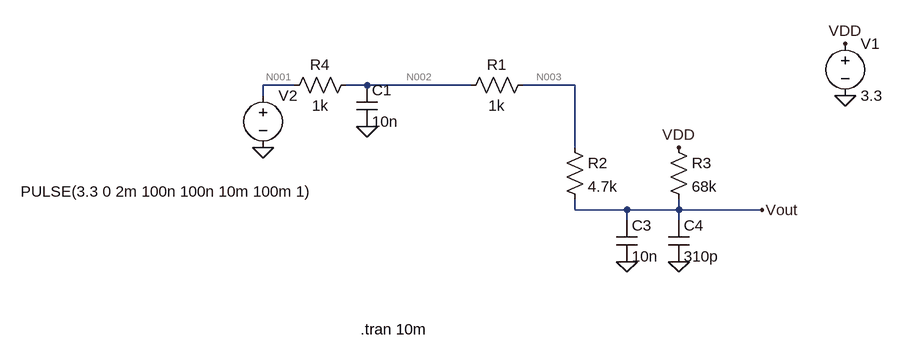
[diagram p0: schematic Press_Detection_Transient.asc]
Press_Detection_Transient.asc, the LTspice schematic file:
Version 4
SHEET 1 880 680
WIRE -192 160 -240 160
WIRE -80 160 -112 160
WIRE 80 160 -80 160
WIRE 240 160 160 160
WIRE -240 176 -240 160
WIRE 240 256 240 160
WIRE 240 352 240 336
WIRE 320 352 240 352
WIRE 400 352 400 336
WIRE 400 352 320 352
WIRE 528 352 400 352
WIRE 320 368 320 352
WIRE 400 368 400 352
FLAG 320 432 0
FLAG 400 432 0
FLAG -80 224 0
FLAG 528 352 Vout
FLAG 400 256 VDD
FLAG 656 96 VDD
FLAG 656 176 0
FLAG -240 256 0
SYMBOL res 176 144 R90
WINDOW 0 0 56 VBottom 2
WINDOW 3 32 56 VTop 2
SYMATTR InstName R1
SYMATTR Value 1k
SYMBOL cap -96 160 R0
SYMATTR InstName C1
SYMATTR Value 10n
SYMBOL res 224 240 R0
SYMATTR InstName R2
SYMATTR Value 4.7k
SYMBOL cap 304 368 R0
SYMATTR InstName C3
SYMATTR Value 10n
SYMBOL cap 384 368 R0
SYMATTR InstName C4
SYMATTR Value 310p
SYMBOL res 384 240 R0
SYMATTR InstName R3
SYMATTR Value 68k
SYMBOL voltage 656 80 R0
WINDOW 123 0 0 Left 0
WINDOW 39 0 0 Left 0
SYMATTR InstName V1
SYMATTR Value 3.3
SYMBOL voltage -240 160 R0
WINDOW 3 -373 164 Left 2
WINDOW 123 0 0 Left 0
WINDOW 39 0 0 Left 0
SYMATTR InstName V2
SYMATTR Value PULSE(3.3 0 2m 100n 100n 10m 100m 1)
SYMBOL res -96 144 R90
WINDOW 0 0 56 VBottom 2
WINDOW 3 32 56 VTop 2
SYMATTR InstName R4
SYMATTR Value 1k
TEXT -90 536 Left 2 !.tran 10m

The netlist it stands for:
* Press_Detection_Transient.asc
R1 N003 N002 1k
C1 N002 0 10n
R2 N003 Vout 4.7k
C3 Vout 0 10n
C4 Vout 0 310p
R3 VDD Vout 68k
V1 VDD 0 3.3
V2 N001 0 PULSE(3.3 0 2m 100n 100n 10m 100m 1)
R4 N002 N001 1k
.tran 10m
.backanno
.end

* Results of the author's LTspice run, read from the files saved beside the schematic
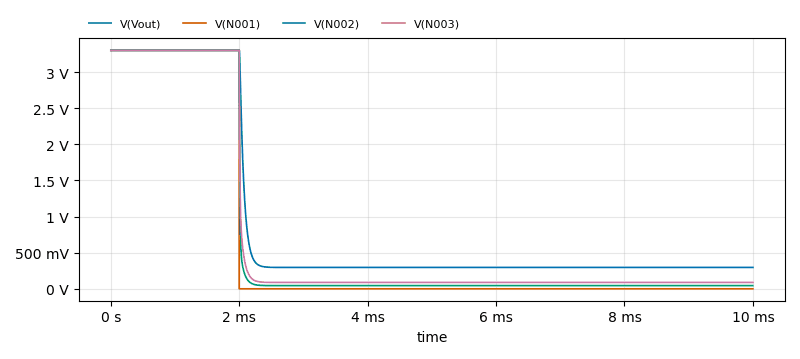
[diagram p1: Transient Analysis of Press_Detection_Transient.asc, plotted from the saved traces]
* Transient Analysis, 1 run:
*   V(Vout): min 296 mV, max 3.3 V, average 918.7 mV, rms 1.516 V, last 296 mV
*   V(N001): min 0 V, max 3.3 V, average 660 mV, rms 1.476 V, last 0 V
*   V(N002): min 44.18 mV, max 3.3 V, average 701.5 mV, rms 1.479 V, last 44.18 mV
*   V(N003): min 88.35 mV, max 3.3 V, average 739.6 mV, rms 1.482 V, last 88.35 mV